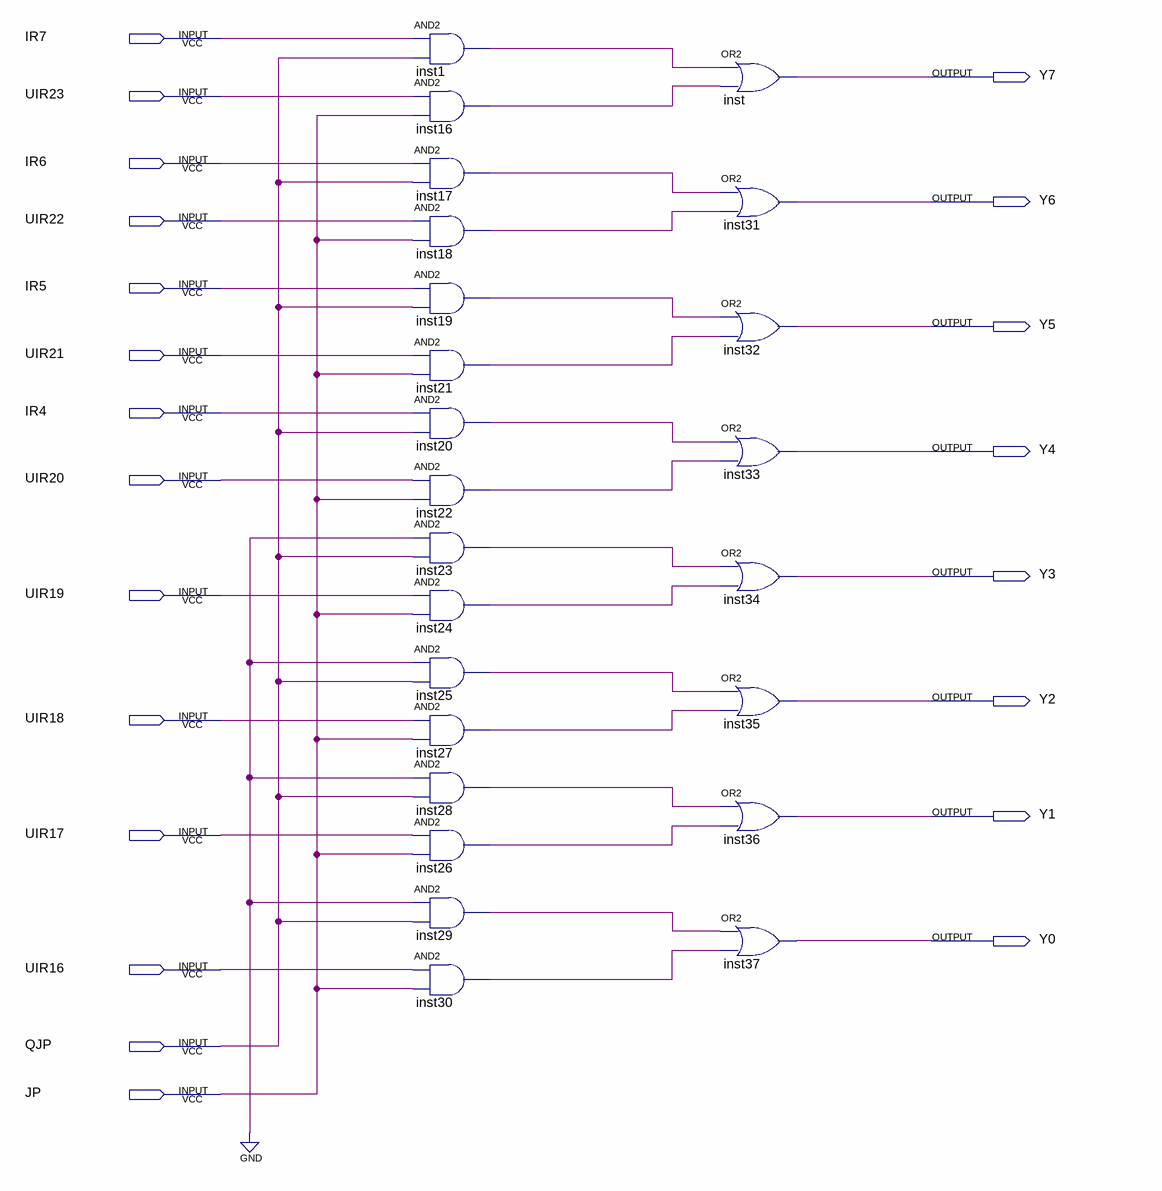
[diagram p0: schematic sheet]
// Quartus schematic 8wei2xuan1.bdf as structural Verilog: 24 symbols, 22 pins
module \8wei2xuan1  (
  input  IR7,
  input  UIR23,
  input  IR6,
  input  UIR22,
  input  IR5,
  input  UIR21,
  input  IR4,
  input  UIR20,
  input  UIR19,
  input  UIR18,
  input  UIR17,
  input  UIR16,
  input  QJP,
  input  JP,
  output Y7,
  output Y6,
  output Y5,
  output Y4,
  output Y3,
  output Y2,
  output Y1,
  output Y0
);

  wire inst1_out, inst16_out, inst17_out, inst18_out, inst19_out, inst20_out, inst21_out, inst22_out,
       inst23_out, inst24_out, inst25_out, inst26_out, inst27_out, inst28_out, inst29_out, inst30_out;

  and inst1 (inst1_out, IR7, QJP);
  and inst16 (inst16_out, UIR23, JP);
  and inst17 (inst17_out, IR6, QJP);
  and inst18 (inst18_out, UIR22, JP);
  and inst19 (inst19_out, IR5, QJP);
  and inst21 (inst21_out, UIR21, JP);
  and inst20 (inst20_out, IR4, QJP);
  and inst22 (inst22_out, UIR20, JP);
  and inst23 (inst23_out, 1'b0, QJP);
  and inst24 (inst24_out, UIR19, JP);
  and inst25 (inst25_out, 1'b0, QJP);
  and inst27 (inst27_out, UIR18, JP);
  and inst28 (inst28_out, 1'b0, QJP);
  and inst26 (inst26_out, UIR17, JP);
  and inst29 (inst29_out, 1'b0, QJP);
  and inst30 (inst30_out, UIR16, JP);
  or inst (Y7, inst1_out, inst16_out);
  or inst31 (Y6, inst17_out, inst18_out);
  or inst32 (Y5, inst19_out, inst21_out);
  or inst33 (Y4, inst20_out, inst22_out);
  or inst34 (Y3, inst23_out, inst24_out);
  or inst35 (Y2, inst25_out, inst27_out);
  or inst36 (Y1, inst28_out, inst26_out);
  or inst37 (Y0, inst29_out, inst30_out);
endmodule
